# EAGLE schematic led_cube_schematic (EAGLE 7.7.0)
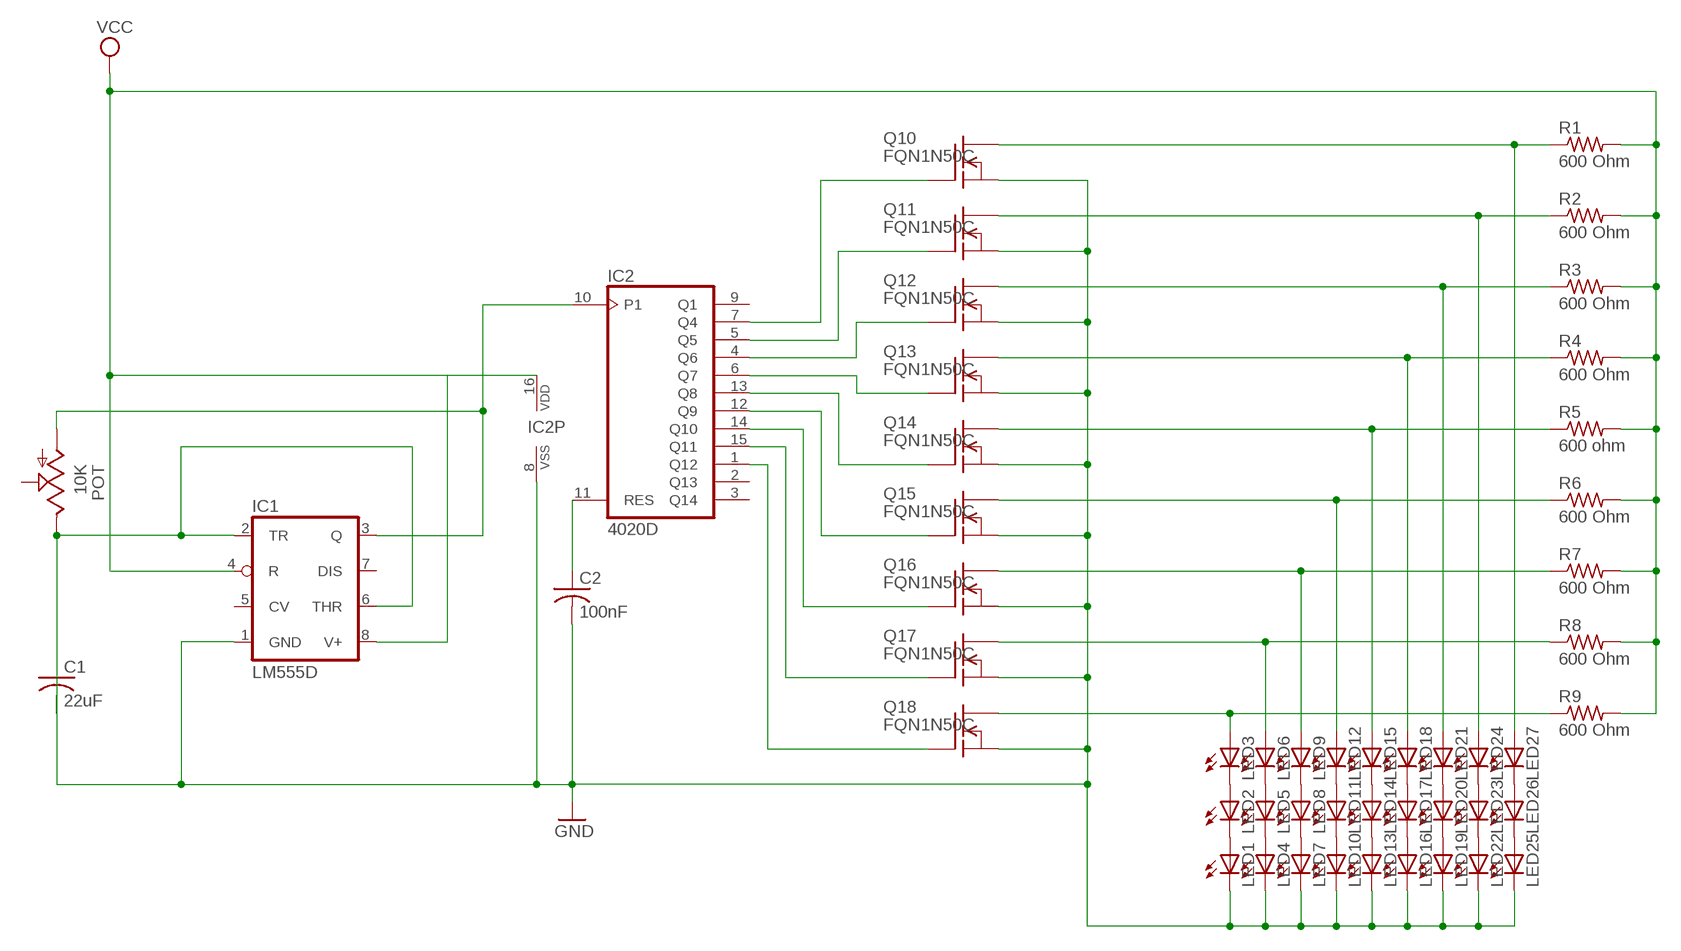
[diagram p0: schematic, sheet 1]

## Parts
C1  22uF  C-US075-032X103  [C075-032X103]
C2  100nF  C-US075-032X103  [C075-032X103]
IC1  LM555D  [SO08]
IC2  4020D  [SO16]
LED1  LEDB155  [Q62902-B155]
LED2  LEDB155  [Q62902-B155]
LED3  LEDB155  [Q62902-B155]
LED4  LEDB155  [Q62902-B155]
LED5  LEDB155  [Q62902-B155]
LED6  LEDB155  [Q62902-B155]
LED7  LEDB155  [Q62902-B155]
LED8  LEDB155  [Q62902-B155]
LED9  LEDB155  [Q62902-B155]
LED10  LEDB155  [Q62902-B155]
LED11  LEDB155  [Q62902-B155]
LED12  LEDB155  [Q62902-B155]
LED13  LEDB155  [Q62902-B155]
LED14  LEDB155  [Q62902-B155]
LED15  LEDB155  [Q62902-B155]
LED16  LEDB155  [Q62902-B155]
LED17  LEDB155  [Q62902-B155]
LED18  LEDB155  [Q62902-B155]
LED19  LEDB155  [Q62902-B155]
LED20  LEDB155  [Q62902-B155]
LED21  LEDB155  [Q62902-B155]
LED22  LEDB155  [Q62902-B155]
LED23  LEDB155  [Q62902-B155]
LED24  LEDB155  [Q62902-B155]
LED25  LEDB155  [Q62902-B155]
LED26  LEDB155  [Q62902-B155]
LED27  LEDB155  [Q62902-B155]
POT  10K  TRIM_US-LI15  [LI15]
Q10  FQN1N50C  [TO92]
Q11  FQN1N50C  [TO92]
Q12  FQN1N50C  [TO92]
Q13  FQN1N50C  [TO92]
Q14  FQN1N50C  [TO92]
Q15  FQN1N50C  [TO92]
Q16  FQN1N50C  [TO92]
Q17  FQN1N50C  [TO92]
Q18  FQN1N50C  [TO92]
R1  600 Ohm  R-US_0309/12  [0309/12]
R2  600 Ohm  R-US_0309/12  [0309/12]
R3  600 Ohm  R-US_0309/12  [0309/12]
R4  600 Ohm  R-US_0309/12  [0309/12]
R5  600 ohm  R-US_0309/12  [0309/12]
R6  600 Ohm  R-US_0309/12  [0309/12]
R7  600 Ohm  R-US_0309/12  [0309/12]
R8  600 Ohm  R-US_0309/12  [0309/12]
R9  600 Ohm  R-US_0309/12  [0309/12]

## Nets
GND: C1.1 C2.2 IC1.1(GND) IC2.8(VSS) LED1.K(C) LED4.K(C) LED7.K(C) LED10.K(C) LED13.K(C) LED16.K(C) LED19.K(C) LED22.K(C) LED25.K(C) Q10.3(S) Q11.3(S) Q12.3(S) Q13.3(S) Q14.3(S) Q15.3(S) Q16.3(S) Q17.3(S) Q18.3(S)
N$1: C1.2 IC1.2(TR) IC1.6(THR) POT.E
N$2: IC2.1(Q12) Q18.1(G)
N$3: IC1.3(Q) IC2.10(P1) POT.A
N$4: IC2.15(Q11) Q17.1(G)
N$5: C2.1 IC2.11(RES)
N$6: IC2.14(Q10) Q16.1(G)
N$7: IC2.12(Q9) Q15.1(G)
N$8: IC2.13(Q8) Q14.1(G)
N$9: IC2.6(Q7) Q13.1(G)
N$10: IC2.4(Q6) Q12.1(G)
N$11: IC2.5(Q5) Q11.1(G)
N$12: IC2.7(Q4) Q10.1(G)
N$13: LED1.A LED2.K(C)
N$14: LED2.A LED3.K(C)
N$15: LED4.A LED5.K(C)
N$16: LED5.A LED6.K(C)
N$17: LED7.A LED8.K(C)
N$18: LED8.A LED9.K(C)
N$19: LED10.A LED11.K(C)
N$20: LED11.A LED12.K(C)
N$21: LED13.A LED14.K(C)
N$22: LED14.A LED15.K(C)
N$23: LED16.A LED17.K(C)
N$24: LED17.A LED18.K(C)
N$25: LED19.A LED20.K(C)
N$26: LED20.A LED21.K(C)
N$27: LED22.A LED23.K(C)
N$28: LED23.A LED24.K(C)
N$29: LED25.A LED26.K(C)
N$30: LED26.A LED27.K(C)
N$31: LED3.A Q18.2(D) R9.1
N$32: LED6.A Q17.2(D) R8.1
N$33: LED9.A Q16.2(D) R7.1
N$34: LED12.A Q15.2(D) R6.1
N$35: LED15.A Q14.2(D) R5.1
N$36: LED18.A Q13.2(D) R4.1
N$37: LED21.A Q12.2(D) R3.1
N$38: LED24.A Q11.2(D) R2.1
N$39: LED27.A Q10.2(D) R1.1
N$40: R1.2 R2.2 R3.2 R4.2 R5.2 R6.2 R7.2 R8.2 R9.2
VCC: IC1.4(R) IC1.8(V+) IC2.16(VDD)
Unconnected: IC1.5(CV) IC1.7(DIS) IC2.2(Q13) IC2.3(Q14) IC2.9(Q1) POT.S

## Library data of the parts
C1 C2 = adafruit:C-US: CAPACITOR, American symbol
IC1 = adafruit:*555: TIMER Changed DIP package to have round (not oval) pin pads http://www.ladyada.net/library/pcb/eaglelibrary.html
IC2 = 40xx:4020: 14-stage binary/ripple COUNTER
LED1-LED27 = adafruit:LED: LED OSRAM: - CHIPLED LG R971, LG N971, LY N971, LG Q971, LY Q971, LO R971, LY R971 LH N974, LH R974 LS Q976, LO Q976, LY Q976 LO Q996 - Hyper CHIPLED LW Q18S LB Q993, LB Q99A, LB R99A - SideLED LS A670, LO A670, LY A670, LG A670, LP A670 LB A673, LV A673, LT A673, LW A673 LH A674 LY A675 LS A676, LA A676, LO A676, LY A676, LW A676 LS A679, LY A679, LG A679 - Hyper Micro SIDELED® LS Y876, LA Y876, LO Y876, LY Y876 LT Y87S - SmartLED LW L88C, LW L88S LB L89C, LB L89S, LG L890 LS L89K, LO L89K, LY L89K LS L896, LA L896, LO L896, LY L896 - TOPLED LS T670, LO T670, LY T670, LG T670, LP T670 LSG T670, LSP T670, LSY T670, LOP T670, LYG T670 LG T671, LOG T671, LSG T671 LB T673, LV T673, LT T673, LW T673 LH T674 LS T676, LA T676, LO T676, LY T676, LB T676, LH T676, LSB T676, LW T676 LB T67C, LV T67C, LT T67C, LS T67K, LO T67K, LY T67K, LW E67C LS E67B, LA E67B, LO E67B, LY E67B, LB E67C, LV E67C, LT E67C LW T67C LS T679, LY T679, LG T679 LS T770, LO T770, LY T770, LG T770, LP T770 LB T773, LV T773, LT T773, LW T773 LH T774 LS E675, LA E675, LY E675, LS T675 LS T776, LA T776, LO T776, LY T776, LB T776 LHGB T686 LT T68C, LB T68C - Hyper Mini TOPLED® LB M676 - Mini TOPLED Santana® LG M470 LS M47K, LO M47K, LY M47K Source: http://www.osram.convergy.de/
POT = pot:TRIM_US-: POTENTIOMETER
Q10-Q18 = adafruit:FQN1N50C: N-Channel Enhancement MOSFET 500V, 0.4A, 6.0 Ohm
R1-R9 = resistor:R-US_: RESISTOR, American symbol